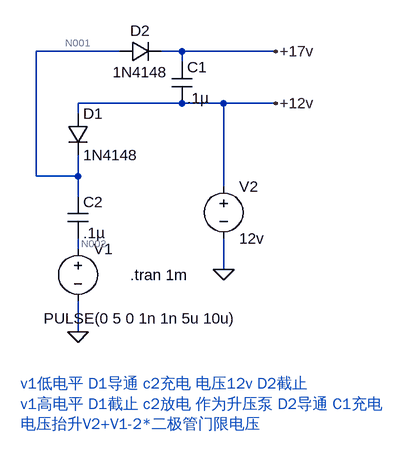
[diagram p0: schematic Draft5.asc]
Draft5.asc, the LTspice schematic file:
Version 4.1
SHEET 1 880 680
WIRE 176 -16 48 -16
WIRE 272 -16 240 -16
WIRE 416 -16 272 -16
WIRE 272 0 272 -16
WIRE 272 64 112 64
WIRE 336 64 272 64
WIRE 416 64 336 64
WIRE 112 80 112 64
WIRE 48 176 48 -16
WIRE 112 176 112 144
WIRE 112 176 48 176
WIRE 336 192 336 64
WIRE 112 208 112 176
WIRE 112 288 112 272
WIRE 336 320 336 272
WIRE 112 416 112 368
FLAG 112 416 0
FLAG 336 320 0
FLAG 416 -16 +17v
FLAG 416 64 +12v
SYMBOL voltage 112 272 R0
WINDOW 3 -53 123 Left 2
WINDOW 123 0 0 Left 0
WINDOW 39 0 0 Left 0
SYMATTR InstName V1
SYMATTR Value PULSE(0 5 0 1n 1n 5u 10u)
SYMBOL voltage 336 176 R0
SYMATTR InstName V2
SYMATTR Value 12v
SYMBOL diode 96 80 R0
SYMATTR InstName D1
SYMATTR Value 1N4148
SYMBOL diode 176 0 R270
WINDOW 0 32 32 VTop 2
WINDOW 3 0 32 VBottom 2
SYMATTR InstName D2
SYMATTR Value 1N4148
SYMBOL cap 256 0 R0
SYMATTR InstName C1
SYMATTR Value .1µ
SYMBOL cap 96 208 R0
SYMATTR InstName C2
SYMATTR Value .1µ
TEXT 192 328 Left 2 !.tran 1m
TEXT 24 496 Left 2 ;v1低电平 D1导通 c2充电 电压12v D2截止\nv1高电平 D1截止 c2放电 作为升压泵 D2导通 C1充电\n电压抬升V2+V1-2*二极管门限电压

The netlist it stands for:
* Draft5.asc
V1 N002 0 PULSE(0 5 0 1n 1n 5u 10u)
V2 +12v 0 12v
D1 +12v N001 1N4148
D2 N001 +17v 1N4148
C1 +17v +12v .1µ
C2 N001 N002 .1µ
.model D D
.lib standard.dio
.tran 1m
* v1低电平 D1导通 c2充电 电压12v D2截止
* v1高电平 D1截止 c2放电 作为升压泵 D2导通 C1充电
* 电压抬升V2+V1-2*二极管门限电压
.backanno
.end

* Results of the author's LTspice run, read from the files saved beside the schematic
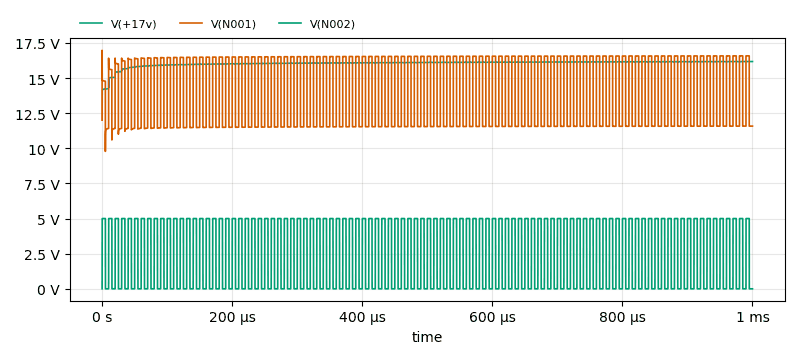
[diagram p1: Transient Analysis of Draft5.asc, plotted from the saved traces]
* Transient Analysis, 1 run:
*   V(+17v): min 12 V, max 16.17 V, average 16.04 V, rms 16.05 V, last 16.17 V
*   V(N001): min 9.781 V, max 16.97 V, average 14.01 V, rms 14.23 V, last 11.58 V
*   V(N002): min 0 V, max 5 V, average 2.501 V, rms 3.536 V, last 0 V